# Altium schematic sheet Jump Stater.SchDoc
size A2; SheetNumber: 1; SheetTotal: 1
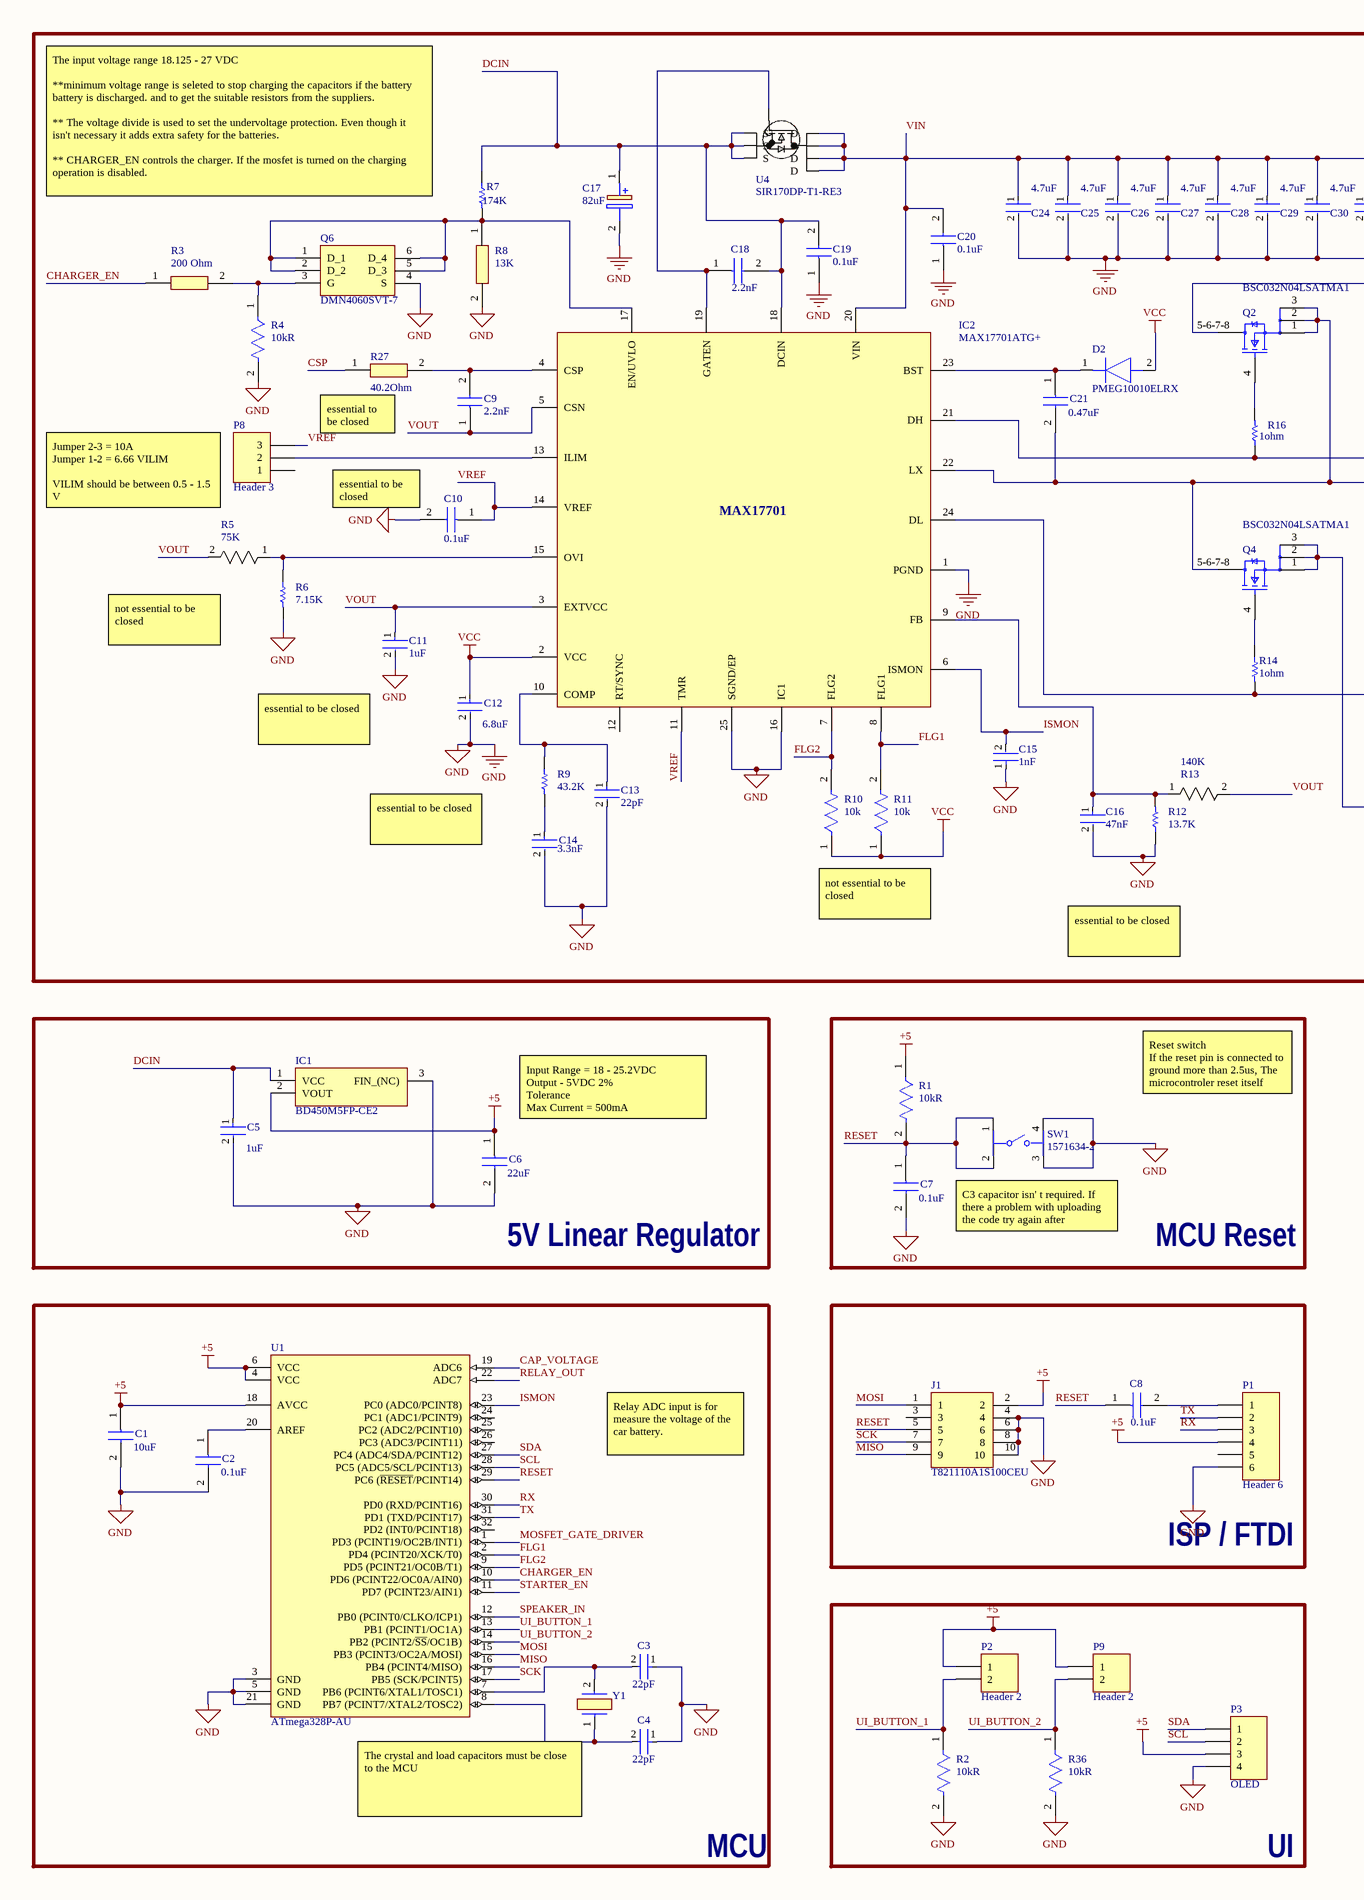
[diagram p0: Jump Stater.SchDoc, left]
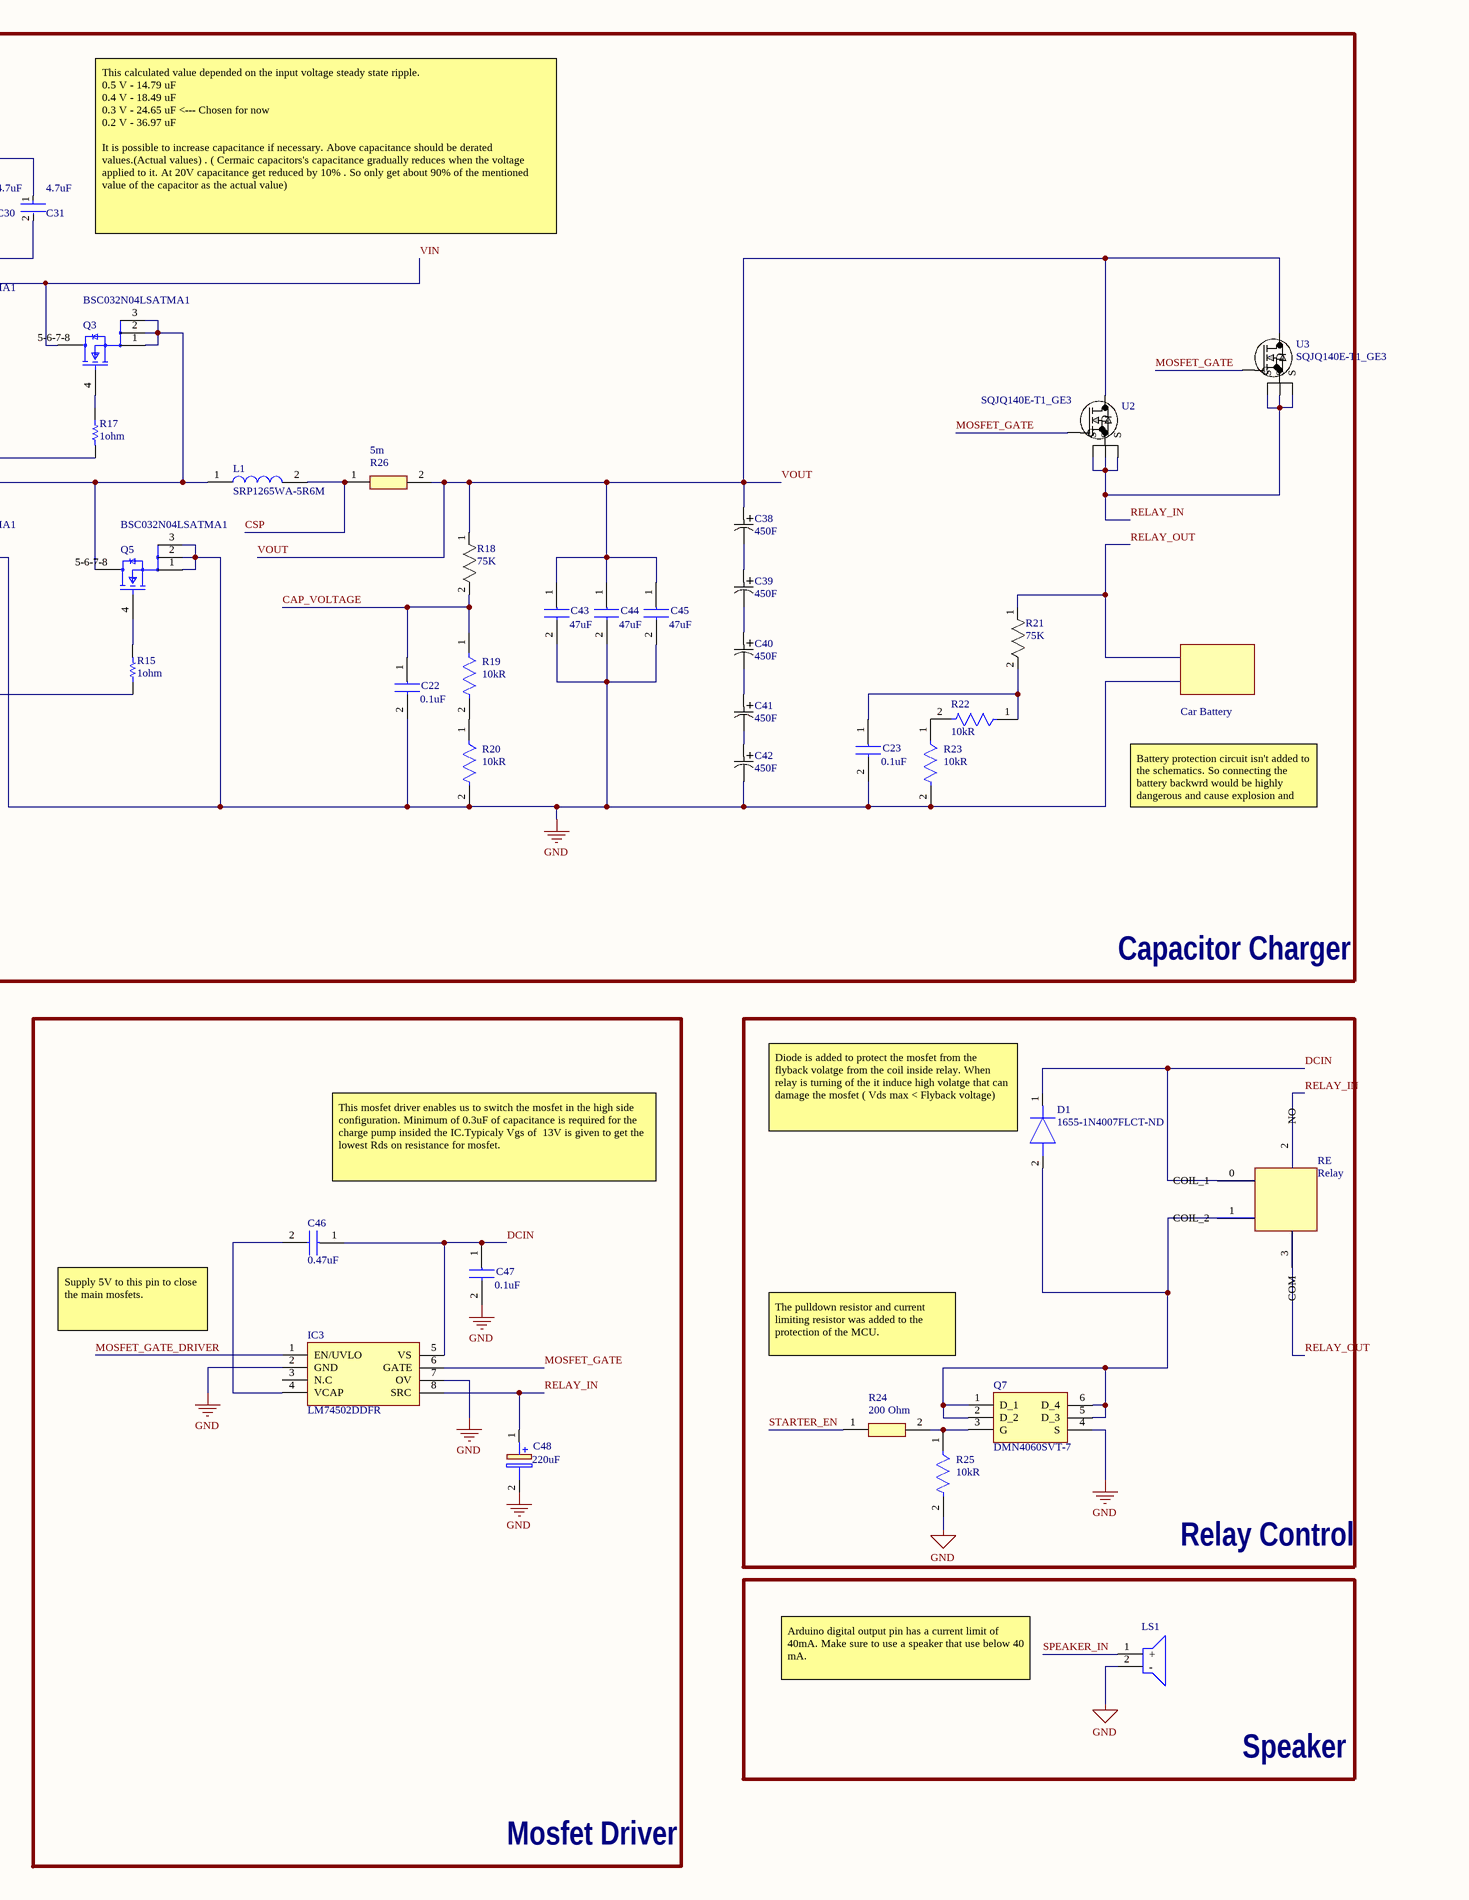
[diagram p1: Jump Stater.SchDoc, right]

## Parts
C1  Capacitance: 10uF  [CAPC3216X180N]  (hidden comment: CL31A106MAHNNNE)
C2  Capacitance: 0.1uF  [CAPC3216X100N]  (hidden comment: CL31B104KBCNNNC)
C3  Capacitance: 22pF  [FP-CL31-IPC_A]  (hidden comment: CL31C220JBCNNNC)
C4  Capacitance: 22pF  [FP-CL31-IPC_A]  (hidden comment: CL31C220JBCNNNC)
C5  Capacitance: 1uF  [FP-CL31-IPC_B]  (hidden comment: CL31B105KBHNNNE)
C6  Capacitance: 22uF  [CAPAE660X600N]  (hidden comment: A766EB226M1DLAE060)
C7  Capacitance: 0.1uF  [CAPC3216X100N]  (hidden comment: CL31B104KBCNNNC)
C8  Capacitance: 0.1uF  [CAPC3216X100N]  (hidden comment: CL31B104KBCNNNC)
C9  Capacitance: 2.2nF  [CAPC3216X90N]  (hidden comment: 1206B222K500CT)
C10  Capacitance: 0.1uF  [CAPC3216X100N]  (hidden comment: CL31B104KBCNNNC)
C11  Capacitance: 1uF  [FP-CL31-IPC_B]  (hidden comment: CL31B105KBHNNNE)
C12  Capacitance: 6.8uF  [FP-C3216-160-0_2-IPC_A]  (hidden comment: C3216X7R1C685K160AC)
C13  Capacitance: 22pF  [FP-CL31-IPC_A]  (hidden comment: CL31C220JBCNNNC)
C14  Capacitance: 3.3nF  [FP-1206-L_3_2_0_2-W_1_6_0-MFG]  (hidden comment: 12065A332JAT2A)
C15  Capacitance: 1nF  [FP-CL31-IPC_C]  (hidden comment: CL31B102KBCNNNC)
C16  Capacitance: 47nF  [FP-CL31-IPC_B]  (hidden comment: CL31B473KBCNNNC)
C17  Capacitance: 82uF  [CAPAE830X1240N]  (hidden comment: A768KS826M1HLAS020)
C18  Capacitance: 2.2nF  [CAPC3216X90N]  (hidden comment: 1206B222K500CT)
C19  Capacitance: 0.1uF  [CAPC3216X100N]  (hidden comment: CL31B104KBCNNNC)
C20  Capacitance: 0.1uF  [CAPC3216X100N]  (hidden comment: CL31B104KBCNNNC)
C21  Capacitance: 0.47uF  [CAPC3216X180N]  (hidden comment: CL31B474KBHNNNE)
C22  Capacitance: 0.1uF  [CAPC3216X100N]  (hidden comment: CL31B104KBCNNNC)
C23  Capacitance: 0.1uF  [CAPC3216X100N]  (hidden comment: CL31B104KBCNNNC)
C24  Capacitance: 4.7uF  [FP-GRM319-0_15-IPC_C]  (hidden comment: GRM319R61H475KA12D)
C25  Capacitance: 4.7uF  [FP-GRM319-0_15-IPC_C]  (hidden comment: GRM319R61H475KA12D)
C26  Capacitance: 4.7uF  [FP-GRM319-0_15-IPC_C]  (hidden comment: GRM319R61H475KA12D)
C27  Capacitance: 4.7uF  [FP-GRM319-0_15-IPC_C]  (hidden comment: GRM319R61H475KA12D)
C28  Capacitance: 4.7uF  [FP-GRM319-0_15-IPC_C]  (hidden comment: GRM319R61H475KA12D)
C29  Capacitance: 4.7uF  [FP-GRM319-0_15-IPC_C]  (hidden comment: GRM319R61H475KA12D)
C30  Capacitance: 4.7uF  [FP-GRM319-0_15-IPC_C]  (hidden comment: GRM319R61H475KA12D)
C31  Capacitance: 4.7uF  [FP-GRM319-0_15-IPC_C]  (hidden comment: GRM319R61H475KA12D)
C38  450F  [PCAP_TPLH-3R0/450SS35X71_TCT]
C39  450F  [PCAP_TPLH-3R0/450SS35X71_TCT]
C40  450F  [PCAP_TPLH-3R0/450SS35X71_TCT]
C41  450F  [PCAP_TPLH-3R0/450SS35X71_TCT]
C42  450F  [PCAP_TPLH-3R0/450SS35X71_TCT]
C43  Capacitance: 47uF  [CAPC3216X180N]  (hidden comment: C3216X5R1E476M160AC.)
C44  Capacitance: 47uF  [CAPC3216X180N]  (hidden comment: C3216X5R1E476M160AC.)
C45  Capacitance: 47uF  [CAPC3216X180N]  (hidden comment: C3216X5R1E476M160AC.)
C46  Capacitance: 0.47uF  [CAPC3216X180N]  (hidden comment: CL31B474KBHNNNE)
C47  Capacitance: 0.1uF  [CAPC3216X100N]  (hidden comment: CL31B104KBCNNNC)
C48  Capacitor: 220uF  [CAPAE1030X1270N]  (hidden comment: A768MS227M1GLAS022)
D1  1655-1N4007FLCT-ND  [SODFL3718X140N]
D2  PMEG10010ELRX  [SODFL3517X110N]
IC1  BD450M5FP-CE2  [ROHM_TO-252-3]
IC2  MAX17701ATG+  [QFN50P400X400X80-25N-D]
IC3  LM74502DDFR  [SOT65P280X110-8N]
J1  T821110A1S100CEU  [SHDR10W64P254X254_2X5_2032X895X915P]
L1  SRP1265WA-5R6M  [SRP1265WA5R6M]
LS1  (no value)  [CMI12950585T]
P1  Header 6  [HDR1X6]
P2  Header 2  [HDR1X2]
P3  OLED  [HDR1X4]
P8  Header 3  [HDR1X3]
P9  Header 2  [HDR1X2]
Q2  BSC032N04LSATMA1  [FP-PG-TDSON-8-MFG]
Q3  BSC032N04LSATMA1  [FP-PG-TDSON-8-MFG]
Q4  BSC032N04LSATMA1  [FP-PG-TDSON-8-MFG]
Q5  BSC032N04LSATMA1  [FP-PG-TDSON-8-MFG]
Q6  DMN4060SVT-7  [SOT95P280X100-6N]
Q7  DMN4060SVT-7  [SOT95P280X100-6N]
R1  Resistance: 10kR  [FP-RMCF1206-IPC_B]  (hidden comment: RMCF1206FT10K0)
R2  Resistance: 10kR  [FP-RMCF1206-IPC_B]  (hidden comment: RMCF1206FT10K0)
R3  Resistance: 200 Ohm  [RESC3216X70N]  (hidden comment: RMCF1206FT200R)
R4  Resistance: 10kR  [FP-RMCF1206-IPC_B]  (hidden comment: RMCF1206FT10K0)
R5  Resistance: 75K  [RC1206N_YAG]  (hidden comment: RC1206FR-0775KL)
R6  Resistance: 7.15K  [RESC3116X65X40ML10T20]  (hidden comment: RC1206FR-077K15L)
R7  value 174K  [RESC1206(3216)_L]  (hidden comment: 311-174KFRCT-ND)
R8  Resistance: 13K  [RESC3116X65N]  (hidden comment: RC1206FR-0713KL)
R9  Resistance: 43.2K  [RESC3116X65X40ML10T20]  (hidden comment: RC1206FR-0743K2L)
R10  Resistance: 10k  [FP-RMCF1206-IPC_B]  (hidden comment: RMCF1206FT10K0)
R11  Resistance: 10k  [FP-RMCF1206-IPC_B]  (hidden comment: RMCF1206FT10K0)
R12  Resistance: 13.7K  [RESC3216X70X40ML20T20]  (hidden comment: RK73H2BTTD1372F)
R13  Resistance: 140K  [RES_RMCF1206_STP]  (hidden comment: RMCF1206FT140K)
R14  Resistance: 1ohm  [RESC3216X70X40LL20T20]  (hidden comment: RK73H2BTTD1R00F)
R15  Resistance: 1ohm  [RESC3216X70X40LL20T20]  (hidden comment: RK73H2BTTD1R00F)
R16  Resistance: 1ohm  [RESC3216X70X40LL20T20]  (hidden comment: RK73H2BTTD1R00F)
R17  Resistance: 1ohm  [RESC3216X70X40LL20T20]  (hidden comment: RK73H2BTTD1R00F)
R18  Resistance: 75K  [RC1206N_YAG]  (hidden comment: RC1206FR-0775KL)
R19  Resistance: 10kR  [FP-RMCF1206-IPC_B]  (hidden comment: RMCF1206FT10K0)
R20  Resistance: 10kR  [FP-RMCF1206-IPC_B]  (hidden comment: RMCF1206FT10K0)
R21  Resistance: 75K  [RC1206N_YAG]  (hidden comment: RC1206FR-0775KL)
R22  Resistance: 10kR  [FP-RMCF1206-IPC_B]  (hidden comment: RMCF1206FT10K0)
R23  Resistance: 10kR  [FP-RMCF1206-IPC_B]  (hidden comment: RMCF1206FT10K0)
R24  Resistance: 200 Ohm  [RESC3216X70N]  (hidden comment: RMCF1206FT200R)
R25  Resistance: 10kR  [FP-RMCF1206-IPC_B]  (hidden comment: RMCF1206FT10K0)
R26  Resistance: 5m  [RESC6432X80N]  (hidden comment: CRF2512-FZ-R005ELF)
R27  Resistance: 40.2Ohm  [RESC3016X65N]  (hidden comment: CRT1206-BY-40R2ELF)
R36  Resistance: 10kR  [FP-RMCF1206-IPC_B]  (hidden comment: RMCF1206FT10K0)
RE  Relay  [PCBComponent_1]
SW1  1571634-2  [FP-1571634-2-MFG]
U1  ATmega328P-AU  [32A_M]
U2  SQJQ140E-T1_GE3  [DPAK_140E-T1_GE3_VIS]
U3  SQJQ140E-T1_GE3  [DPAK_140E-T1_GE3_VIS]
U4  SIR170DP-T1-RE3  [MOSFET_DP-T1-RE3_VIS]
Y1  ECS-160-20-3X-TR  [ECS160203XTR]  (value not drawn)

## Blocks framed on the sheet
Capacitor Charger: C9-C31 C38-C45 D2 IC2 L1 P8 Q2-Q6 R3-R23 R26 R27 U2-U4
5V Linear Regulator: C5 C6 IC1
MCU Reset: C7 R1 SW1
Mosfet Driver: C46-C48 IC3
Relay Control: D1 Q7 R24 R25 RE
MCU: C1-C4 U1 Y1
ISP / FTDI: C8 J1 P1
Speaker: LS1
UI: P2 P3 P9 R2 R36

## Nets
+5: C1.1 C6.1(+) IC1.2(VOUT) J1.2 P1.4 P2.1 P3.3 P9.1 R1.1 U1.4(VCC) U1.6(VCC) U1.18(AVCC)
GND: C1.2 C2.2 C3.1 C4.1 C5.2 C6.2(-) C7.2 C10.2 C11.2 C12.2 C13.2 C14.2 C15.1 C16.2 C17.2(-) C19.1 C20.1 C22.2 C23.2 C24.2 C25.2 C26.2 C27.2 C28.2 C29.2 C30.2 C31.2 C42.2 C43.2 C44.2 C45.2 C47.2 C48.2(-) IC1.3(FIN_(NC)) IC2.1(PGND) IC2.16(IC1) IC2.25(SGND/EP) IC3.2(GND) IC3.7(OV) J1.4 J1.6 J1.8 J1.10 LS1.2(-) P1.6 P3.4 Q4.1(S) Q4.2(S) Q4.3(S) Q5.1(S) Q5.2(S) Q5.3(S) Q6.4(S) Q7.4(S) R2.2 R4.2 R6.2 R8.2 R12.1 R20.2 R23.2 R25.2 R36.2 SW1.3 SW1.4 U1.3(GND) U1.5(GND) U1.21(GND)
VCC: C12.1 D2.2(A) IC2.2(VCC) R10.1 R11.1
CAP_VOLTAGE: C22.1 R18.2 R19.1 U1.19(ADC6)
CHARGER_EN: R3.1 U1.10(PD6_(PCINT22/OC0A/AIN0))
CSP: L1.2 R26.1 R27.1
DCIN: C5.1 C17.1(+) C18.2 C19.2 C46.1 C47.1 D1.1(K) IC1.1(VCC) IC2.18(DCIN) IC3.5(VS) R7.1 RE.0(COIL_1) U4.1(S) U4.2(S) U4.3(S)
FLG1: IC2.8(FLG1) R11.2 U1.2(PD4_(PCINT20/XCK/T0))
FLG2: IC2.7(FLG2) R10.2 U1.9(PD5_(PCINT21/OC0B/T1))
ISMON: C15.2 IC2.6(ISMON) U1.23(PC0_(ADC0/PCINT8))
MISO: J1.9 U1.16(PB4_(PCINT4/MISO))
MOSFET_GATE: IC3.6(GATE) U2.4(G) U3.4(G)
MOSFET_GATE_DRIVER: IC3.1(EN/UVLO) U1.1(PD3_(PCINT19/OC2B/INT1))
MOSI: J1.1 U1.15(PB3_(PCINT3/OC2A/MOSI))
RELAY_IN: C48.1(+) IC3.8(SRC) RE.2(NO) U2.1(S) U2.2(S) U2.3(S) U3.1(S) U3.2(S) U3.3(S)
RELAY_OUT: R21.1 RE.3(COM) U1.22(ADC7)
RESET: C7.1 C8.1 J1.5 R1.2 SW1.1 SW1.2 U1.29(PC6_(~{RESET}/PCINT14))
RX: P1.3 U1.30(PD0_(RXD/PCINT16))
SCK: J1.7 U1.17(PB5_(SCK/PCINT5))
SCL: P3.2 U1.28(PC5_(ADC5/SCL/PCINT13))
SDA: P3.1 U1.27(PC4_(ADC4/SDA/PCINT12))
SPEAKER_IN: LS1.1(+) U1.12(PB0_(PCINT0/CLKO/ICP1))
STARTER_EN: R24.1 U1.11(PD7_(PCINT23/AIN1))
TX: P1.2 U1.31(PD1_(TXD/PCINT17))
UI_BUTTON_1: P2.2 R2.1 U1.13(PB1_(PCINT1/OC1A))
UI_BUTTON_2: P9.2 R36.1 U1.14(PB2_(PCINT2/~{SS}/OC1B))
VIN: C20.2 C24.1 C25.1 C26.1 C27.1 C28.1 C29.1 C30.1 C31.1 IC2.20(VIN) Q2.5-6-7-8(D) Q3.5-6-7-8(D) U4.5(D) U4.6(D) U4.7(D) U4.8(D)
VOUT: C9.1 C11.1 C38.1 C43.1 C44.1 C45.1 IC2.3(EXTVCC) IC2.5(CSN) R5.2 R13.2 R18.1 R26.2 U2.5(D) U3.5(D)
VREF: C10.1 IC2.11(TMR) IC2.14(VREF) P8.3
NetC2_1: C2.1 U1.20(AREF)
NetC3_2: C3.2 U1.7(PB6_(PCINT6/XTAL1/TOSC1)) Y1.2(X2)
NetC4_2: C4.2 U1.8(PB7_(PCINT7/XTAL2/TOSC2)) Y1.1(X1)
NetC8_2: C8.2 P1.1
NetC9_2: C9.2 IC2.4(CSP) R27.2
NetC13_1: C13.1 IC2.10(COMP) R9.1
NetC14_1: C14.1 R9.2
NetC16_1: C16.1 IC2.9(FB) R12.2 R13.1
NetC18_1: C18.1 IC2.19(GATEN) U4.4(G)
NetC21_1: C21.1 D2.1(K) IC2.23(BST)
NetC21_2: C21.2 IC2.22(LX) L1.1 Q2.1(S) Q2.2(S) Q2.3(S) Q3.1(S) Q3.2(S) Q3.3(S) Q4.5-6-7-8(D) Q5.5-6-7-8(D)
NetC23_1: C23.1 R21.2 R22.1
NetC38_2: C38.2 C39.1
NetC39_2: C39.2 C40.1
NetC40_2: C40.2 C41.1
NetC41_2: C41.2 C42.1
NetC46_2: C46.2 IC3.4(VCAP)
NetD1_2: D1.2(A) Q7.1(D_1) Q7.2(D_2) Q7.5(D_3) Q7.6(D_4) RE.1(COIL_2)
NetIC2_13: IC2.13(ILIM) P8.2
NetIC2_15: IC2.15(OVI) R5.1 R6.1
NetIC2_17: IC2.17(EN/UVLO) Q6.1(D_1) Q6.2(D_2) Q6.5(D_3) Q6.6(D_4) R7.2 R8.1
NetIC2_21: IC2.21(DH) R16.1 R17.2
NetIC2_24: IC2.24(DL) R14.2 R15.1
NetQ2_4: Q2.4(G) R16.2
NetQ3_4: Q3.4(G) R17.1
NetQ4_4: Q4.4(G) R14.1
NetQ5_4: Q5.4(G) R15.2
NetQ6_3: Q6.3(G) R3.2 R4.1
NetQ7_3: Q7.3(G) R24.2 R25.1
NetR19_2: R19.2 R20.1
NetR22_2: R22.2 R23.1

Not connected (* = marked no-connect by the designer): IC2 12(RT/SYNC); IC3 3(N.C); J1 3; P1 5; P8 1; U1 24(PC1_(ADC1/PCINT9)) 25(PC2_(ADC2/PCINT10)) 26(PC3_(ADC3/PCINT11)) 32(PD2_(INT0/PCINT18))

## Notes on the sheet
- The input voltage range 18.125 - 27 VDC
  **minimum voltage range is seleted to stop charging the capacitors if the battery battery is discharged. and to get the suitable resistors from the suppliers.
  ** The voltage divide is used to set the undervoltage protection. Even though it isn't necessary it adds extra safety for the batteries.
  ** CHARGER_EN controls the charger. If the mosfet is turned on the charging operation is disabled.
- This calculated value depended on the input voltage steady state ripple.
  0.5 V - 14.79 uF
  0.4 V - 18.49 uF
  0.3 V - 24.65 uF <--- Chosen for now
  0.2 V - 36.97 uF
  It is possible to increase capacitance if necessary. Above capacitance should be derated values.(Actual values) . ( Cermaic capacitors's capacitance gradually reduces when the voltage applied to it. At 20V capacitance get reduced by 10% . So only get about 90% of the mentioned value of the capacitor as the actual value)
- (near R27) essential to be closed
- Jumper 2-3 = 10A
  Jumper 1-2 = 6.66 VILIM
  VILIM should be between 0.5 - 1.5 V
- (near C10) essential to be closed
- (near R5) not essential to be closed
- essential to be closed
- Car Battery
- Battery protection circuit isn't added to the schematics. So connecting the battery backwrd would be highly dangerous and cause explosion and fires in the battery.
- not essential to be closed
- (near C6) Input Range = 18 - 25.2VDC
  Output - 5VDC 2%
  Tolerance
  Max Current = 500mA
  TypQ Current = 38uA
- Reset switch
  If the reset pin is connected to ground more than 2.5us, The microcontroler reset itself
- (near D1) Diode is added to protect the mosfet from the flyback volatge from the coil inside relay. When relay is turning of the it induce high volatge that can damage the mosfet ( Vds max < Flyback voltage)
- This mosfet driver enables us to switch the mosfet in the high side configuration. Minimum of 0.3uF of capacitance is required for the charge pump insided the IC.Typicaly Vgs of  13V is given to get the lowest Rds on resistance for mosfet.
- C3 capacitor isn' t required. If there a problem with uploading the code try again after desoldering this
- Supply 5V to this pin to close the main mosfets.
- The pulldown resistor and current limiting resistor was added to the protection of the MCU.
- Relay ADC input is for measure the voltage of the car battery.
- Arduino digital output pin has a current limit of 40mA. Make sure to use a speaker that use below 40 mA.
- The crystal and load capacitors must be close to the MCU
- (in symbol MAX17701ATG+) MAX17701

## Library data of the parts
C1 = CL31A106MAHNNNE: CAP CER 10UF 25V X5R 1206 CL31A106MAHNNNE; Manufacturer_Name: SAMSUNG; Datasheet Link: https://www.arrow.com/en/products/cl31a106mahnnne/samsung-electro-mechanics; Height: 1.8mm; Manufacturer_Part_Number: CL31A106MAHNNNE; Mouser Part Number: 187-CL31A106MAHNNNE; Mouser Price/Stock: https://www.mouser.co.uk/ProductDetail/Samsung-Electro-Mechanics/CL31A106MAHNNNE?qs=9y2YoPkPyvYkOWbcUKSn%252BQ%3D%3D; Arrow Part Number: CL31A106MAHNNNE; Arrow Price/Stock: https://www.arrow.com/en/products/cl31a106mahnnne/samsung-electro-mechanics; Supplier 1: Digi-Key; Supplier Part Number 1: 1276-1181-1-ND
C2 C7 C10 C19 C20 C22 C23 C47 = CL31B104KBCNNNC: CAP CER 0.1UF 50V X7R 1206; Manufacturer_Name: SAMSUNG; Datasheet Link: https://datasheet.datasheetarchive.com/originals/distributors/Datasheets_SAMA/0fdb6a11e020a7299f4d0713dd2bd7ee.pdf; Height: 1mm; Mouser Part Number: 187-CL31B104KBCNNNC; Mouser Price/Stock: https://www.mouser.co.uk/ProductDetail/Samsung-Electro-Mechanics/CL31B104KBCNNNC?qs=349EhDEZ59oHABbyGq1iKA%3D%3D; Arrow Part Number: CL31B104KBCNNNC; Arrow Price/Stock: https://www.arrow.com/en/products/cl31b104kbcnnnc/samsung-electro-mechanics?region=nac; Supplier 1: Digi-Key; Supplier Part Number 1: 1276-1017-1-ND
  C2 C47: Manufacturer_Part_Number 1: CL31B104KBCNNNC
  C7 C10 C19 C20 C22 C23: Manufacturer_Part_Number: CL31B104KBCNNNC
C3 C4 C13 = CMP-13271-001055-1: Cap Ceramic 22pF 50V C0G ±5% SMD 1206 +125°C Embossed T/R; Temperature Coefficient: 300ppm/°C; Packaging: Tape and Reel; Material: Ceramic; Package Quantity: 1; Thickness: 0.039inch; Voltage: 50V; Height: 0.85mm; Radiation Hardening: No; Mount: Surface Mount; Width: 0.063inch; Min Operating Temperature: -55°C; Max Operating Temperature: 125°C; Voltage Rating (DC): 50V; Voltage Rating: 50V; Case/Package: 1206; Case Code (Metric): 3216; Tolerance: 5%; Length: 3.2mm; Dielectric: C0G; Lead Free: Lead Free; Depth: 1.6mm; Case Code (Imperial): 1206
C5 C11 = CMP-13271-001662-1: Cap Ceramic 1uF 50V X7R ±10% SMD 1206 +125°C Embossed T/R; Case Code (Metric): 3216; Packaging: Tape and Reel; Depth: 1.6mm; Max Operating Temperature: 125°C; Length: 3.2mm; Contact Plating: Tin; Voltage Rating (DC): 50V; Radiation Hardening: No; Min Operating Temperature: -55°C; Dielectric: X7R; Voltage: 50V; Lead Free: Lead Free; Package Quantity: 1; Material: Ceramic; Thickness: 0.071inch; Width: 0.063inch; Voltage Rating: 50V; Case Code (Imperial): 1206; Mount: Surface Mount; Case/Package: 1206; Tolerance: 10%; Height: 1.6mm
C6 = A766EB226M1DLAE060: CAP ALUM POLY 22UF 20% 20V SMD; Manufacturer_Name: KEMET; Datasheet Link: https://content.kemet.com/datasheets/KEM_A4089_A766.pdf; Height: 6mm; Manufacturer_Part_Number: A766EB226M1DLAE060; Mouser Part Number: 80-A766EB226M1DLAE60; Mouser Price/Stock: https://www.mouser.co.uk/ProductDetail/KEMET/A766EB226M1DLAE060?qs=vmHwEFxEFR9cZ7fvMzQbpw%3D%3D; Supplier 1: Digi-Key; Supplier Part Number 1: 399-A766EB226M1DLAE060CT-ND
C8 = CL31B104KBCNNNC: CAP CER 0.1UF 50V X7R 1206 CL31B104KBCNNNC; Manufacturer_Name: SAMSUNG; Datasheet Link: https://datasheet.datasheetarchive.com/originals/distributors/Datasheets_SAMA/0fdb6a11e020a7299f4d0713dd2bd7ee.pdf; Height: 1mm; Manufacturer_Part_Number: CL31B104KBCNNNC; Mouser Part Number: 187-CL31B104KBCNNNC; Mouser Price/Stock: https://www.mouser.co.uk/ProductDetail/Samsung-Electro-Mechanics/CL31B104KBCNNNC?qs=349EhDEZ59oHABbyGq1iKA%3D%3D; Arrow Part Number: CL31B104KBCNNNC; Arrow Price/Stock: https://www.arrow.com/en/products/cl31b104kbcnnnc/samsung-electro-mechanics?region=nac; Supplier 1: Digi-Key; Supplier Part Number 1: 1276-1017-1-ND
C9 C18 = 1206B222K500CT: Capacitor; Manufacturer_Name: Walsin Technology Corporation; Datasheet Link: https://eu.mouser.com/datasheet/2/210/WTC_MLCC_General_Purpose-1534899.pdf; Height: 0.9mm; Manufacturer_Part_Number: 1206B222K500CT; Supplier 1: Digi-Key; Supplier Part Number 1: 1292-1608-1-ND
C12 = CMP-08246-004935-1: Multilayer Ceramic Capacitors 6.8uF ±10% 16V X7R SMD 1206; Max Operating Temperature: 125°C; Construction: Flat; Resistor Type: Ceramic; Case Code (Imperial): 1206; Package Quantity: 1; Lead Free: Lead Free; Termination: SMD/SMT; Thickness: 0.071inch; Voltage Rating: 16V; Number of Pins: 2; Depth: 1.6mm; Tolerance: 10%; Radiation Hardening: No; Case Code (Metric): 3216; Length: 3.2mm; RoHS Compliant: Yes; Weight: 0.000571oz; Series: C; Height: 1.6mm; REACH SVHC: No SVHC; Packaging: Tape and Reel; Voltage: 16V; Mount: Surface Mount; Case/Package: 1206; Min Operating Temperature: -55°C; Dielectric Material: Ceramic; Width: 0.063inch; Dielectric: X7R; Voltage Rating (DC): 16V
C14 = CMP-1037-02951-2: General Purpose Ceramic Capacitor, 1206, 3.3nF, 5%, NP0, 30ppm/°C, 50V; Dissipation Factor: 2.5%; Dielectric: C0G; Mount: Surface Mount; Case/Package: 1206; Lead Free: Lead Free; Termination: SMD/SMT; Min Operating Temperature: -55°C; Temperature Coefficient: 30ppm/°C; Series: -; Contact Plating: Tin; Case Code (Imperial): 1206; Length: 3.2mm; REACH SVHC: No SVHC; Width: 0.063inch; Case Code (Metric): 3216; Thickness: 0.05inch; Dielectric Material: Ceramic; Max Operating Temperature: 125°C; Packaging: Tape and Reel; Construction: Flat; Number of Pins: 2; Voltage Rating (DC): 50V; Package Quantity: 1; RoHS Compliant: Yes; Voltage: 50V; Height: 1.27mm; Depth: 1.6mm; Voltage Rating: 50V; Tolerance: 5%; Radiation Hardening: No
C15 = CMP-13271-001948-1: Cap Ceramic 1nF 50V X7R ±10% SMD 1206 +125°C Embossed T/R; Voltage: 63V; Case Code (Imperial): 1206; Depth: 1.6mm; Case Code (Metric): 3216; Width: 0.063inch; Package Quantity: 4000; Height: 0.85mm; Max Operating Temperature: 125°C; Radiation Hardening: No; Thickness: 0.037inch; Tolerance: 10%; Case/Package: 1206; Packaging: Tape and Reel; Voltage Rating (DC): 50V; Min Operating Temperature: -55°C; Material: Ceramic; Length: 3.2mm; Voltage Rating: 50V; Mount: Surface Mount; Lead Free: Lead Free; Dielectric: X7R
C16 = CMP-13271-000358-1: Cap Ceramic 47nF 50V X7R ±10% SMD 1206 +125°C Embossed T/R; Case Code (Metric): 3216; Depth: 1.6mm; Mount: Surface Mount; Min Operating Temperature: -55°C; Case/Package: 1206; Height: 0.85mm; Packaging: Tape and Reel; Thickness: 0.039inch; Max Operating Temperature: 125°C; Dielectric: X7R; Case Code (Imperial): 1206; Material: Ceramic; Tolerance: 10%; Lead Free: Lead Free; Radiation Hardening: No; Voltage Rating (DC): 50V; Length: 3.2mm; Voltage Rating: 50V; Width: 0.063inch; Voltage: 50V
C17 = A768KS826M1HLAS020: CAP ALUM POLY 82UF 20% 50V SMD; Manufacturer_Name: KEMET; Datasheet Link: https://content.kemet.com/datasheets/KEM_A4088_A768.pdf; Height: 12.4mm; Manufacturer_Part_Number: A768KS826M1HLAS020; Mouser Part Number: 80-A768KS826M1HLAS20; Mouser Price/Stock: https://www.mouser.co.uk/ProductDetail/KEMET/A768KS826M1HLAS020?qs=yqaQSyyJnNiK6owm%2FGFRvA%3D%3D; Supplier 1: Digi-Key; Supplier Part Number 1: 399-A768KS826M1HLAS020CT-ND
C21 C46 = CL31B474KBHNNNE: CAP CER 0.47UF 50V X7R 1206; Manufacturer_Name: SAMSUNG; Datasheet Link: https://datasheet.datasheetarchive.com/originals/distributors/Datasheets_SAMA/624d57f8861bc75ef1b47830d520ec0a.pdf; Height: 1.8mm; Manufacturer_Part_Number: CL31B474KBHNNNE; Mouser Part Number: 187-CL31B474KBHNNNE; Mouser Price/Stock: https://www.mouser.co.uk/ProductDetail/Samsung-Electro-Mechanics/CL31B474KBHNNNE?qs=349EhDEZ59olbv7Lkudghw%3D%3D; Arrow Part Number: CL31B474KBHNNNE; Arrow Price/Stock: https://www.arrow.com/en/products/cl31b474kbhnnne/samsung-electro-mechanics?region=nac; Supplier 1: Digi-Key; Supplier Part Number 1: 1276-1118-1-ND
C24-C31 = CMP-06035-020548-1: Chip Multilayer Ceramic Capacitors for General Purpose, 1206, 4.7uF, X5R, 15%, 10%, 50V; Min Operating Temperature: -55°C; Max Operating Temperature: 85°C; Thickness: 850um; Depth: 1.6mm; Material: Ceramic; Voltage Rating: 50V; Mount: Surface Mount; Height: 0.85mm; Length: 3.2mm; Width: 1.6mm; Case/Package: 1206; Packaging: Cut Tape; Dielectric: X5R; Case Code (Metric): 3216; Voltage Rating (DC): 50V; REACH SVHC: No SVHC; Case Code (Imperial): 1206; Voltage: 50V; Tolerance: 10%
C38-C42 = TPLH-3R0/450SS35X71: No Description Available; Mfr_Name: TECATE GROUP; Supplier 1: Digi-Key; Supplier Part Number 1: 2085-TPLH-3R0/450SS35X71-ND
C43-C45 = C3216X5R1E476M160AC.: 47 µF ±20% 25V Ceramic Capacitor X5R 1206 (3216 Metric); Manufacturer_Name: TDK; Datasheet Link: https://media.digikey.com/pdf/Data%20Sheets/TDK%20PDFs/mlcc_commercial_general_Rev2018.pdf; Height: 1.8mm; Manufacturer_Part_Number: C3216X5R1E476M160AC.; Mouser Part Number: N/A; Mouser Price/Stock: https://www.mouser.com/Search/Refine.aspx?Keyword=N%2FA; Supplier 1: Digi-Key; Supplier Part Number 1: 445-8047-1-ND
C48 = A768MS227M1GLAS022: Capacitor Polarised; Manufacturer_Name: KEMET; Datasheet Link: https://connect.kemet.com:7667/gateway/IntelliData-ComponentDocumentation/1.0/download/specsheet/A768MS227M1GLAS022; Height: 12.7mm; Manufacturer_Part_Number: A768MS227M1GLAS022; Supplier 1: Digi-Key; Supplier Part Number 1: 399-A768MS227M1GLAS022CT-ND
D1 = 1N4007FLTR: Diode; Manufacturer_Name: SMC; Datasheet Link: http://www.smc-diodes.com/propdf/1N4001FL-1N4007FL%20N1646%20REV.A.pdf; Height: 1.4mm; Manufacturer_Part_Number: 1N4007FLTR
D2 = PMEG10010ELRX: Diode; Manufacturer_Name: Nexperia; Datasheet Link: https://assets.nexperia.com/documents/data-sheet/PMEG10010ELR.pdf; Height: 1.1mm; Manufacturer_Part_Number: PMEG10010ELRX; Mouser Part Number: 771-PMEG10010ELRX; Mouser Price/Stock: https://www.mouser.co.uk/ProductDetail/Nexperia/PMEG10010ELRX?qs=bel5lzaZNxTBP7lsf64PhA%3D%3D; Arrow Part Number: PMEG10010ELRX; Arrow Price/Stock: https://www.arrow.com/en/products/pmeg10010elrx/nexperia?region=nac; Supplier 1: Digi-Key; Supplier Part Number 1: 1727-2394-1-ND
IC1 = BD450M5FP-CE2: Integrated Circuit; Manufacturer_Name: ROHM Semiconductor; Datasheet Link: https://datasheet.datasheetarchive.com/originals/distributors/DKDS-10/186386.pdf; Manufacturer_Part_Number: BD450M5FP-CE2; Mouser Part Number: 755-BD450M5FP-CE2; Mouser Price/Stock: https://www.mouser.co.uk/ProductDetail/ROHM-Semiconductor/BD450M5FP-CE2?qs=zGux8KhMp6L1UcqyCxjOAw%3D%3D; Supplier 1: Digi-Key; Supplier Part Number 1: BD450M5FP-CE2CT-ND
IC2 = MAX17701ATG+: Integrated Circuit; Manufacturer_Name: Analog Devices; Datasheet Link: https://pdfserv.maximintegrated.com/en/ds/MAX17701.pdf; Height: 0.8mm; Manufacturer_Part_Number: MAX17701ATG+; Mouser Part Number: 700-MAX17701ATG+; Mouser Price/Stock: https://www.mouser.co.uk/ProductDetail/Maxim-Integrated/MAX17701ATG%2b?qs=W%2FMpXkg%252BdQ4lZ0yRy8rVtg%3D%3D; Arrow Part Number: MAX17701ATG+; Arrow Price/Stock: https://www.arrow.com/en/products/max17701atg/maxim-integrated?region=nac; Supplier 1: Digi-Key; Supplier Part Number 1: 175-MAX17701ATG+-ND
IC3 = LM74502DDFR: Integrated Circuit; Manufacturer_Name: Texas Instruments; Datasheet Link: https://www.arrow.com/en/products/lm74502ddfr/texas-instruments?region=nac; Height: 1.1mm; Manufacturer_Part_Number: LM74502DDFR; Mouser Part Number: 595-LM74502DDFR; Mouser Price/Stock: https://www.mouser.co.uk/ProductDetail/Texas-Instruments/LM74502DDFR?qs=doiCPypUmgHnIUX9P1FS2A%3D%3D; Arrow Part Number: LM74502DDFR; Arrow Price/Stock: https://www.arrow.com/en/products/lm74502ddfr/texas-instruments?region=nac; Supplier 1: Digi-Key; Supplier Part Number 1: 296-LM74502DDFRCT-ND
J1 = T821110A1S100CEU: Connector; Manufacturer_Name: Amphenol; Datasheet Link: https://docs.rs-online.com/e09c/0900766b81359cba.pdf; Height: 9.15mm; Manufacturer_Part_Number: T821110A1S100CEU; Mouser Part Number: N/A; Mouser Price/Stock: https://www.mouser.co.uk/ProductDetail/Amphenol/T821110A1S100CEU?qs=3IN%252Br8p6BrNf%2FuKCWm44Bg%3D%3D; Arrow Part Number: T821110A1S100CEU; Arrow Price/Stock: https://www.arrow.com/en/products/t821110a1s100ceu/amphenol-fci?region=europe
L1 = SRP1265WA-5R6M: Inductor; Manufacturer_Name: Bourns; Datasheet Link: http://www.bourns.com/docs/Product-Datasheets/SRP1265WA.pdf; Height: 6.5mm; Manufacturer_Part_Number: SRP1265WA-5R6M; Mouser Part Number: 652-SRP1265WA-5R6M; Mouser Price/Stock: https://www.mouser.co.uk/ProductDetail/Bourns/SRP1265WA-5R6M?qs=81r%252BiQLm7BQx3ztxL9cqwg%3D%3D; Supplier 1: Digi-Key; Supplier Part Number 1: 118-SRP1265WA-5R6MCT-ND
LS1 = CMI-1295-0585T: Loudspeaker or Buzzer; Manufacturer_Name: CUI Devices; Datasheet Link: https://www.cuidevices.com/product/resource/pdf/cmi-1295-0585t.pdf; Height: 9.7mm; Manufacturer_Part_Number: CMI-1295-0585T; Mouser Part Number: 490-CMI-1295-0585T; Mouser Price/Stock: https://www.mouser.co.uk/ProductDetail/CUI-Devices/CMI-1295-0585T?qs=P1JMDcb91o6b8IYPugSq6A%3D%3D; Arrow Part Number: CMI-1295-0585T; Arrow Price/Stock: https://www.arrow.com/en/products/cmi-1295-0585t/cui-devices?region=nac; Supplier 1: Digi-Key; Supplier Part Number 1: 102-CMI-1295-0585T-ND
P1 = Header 6: Header, 6-Pin; LatestRevisionDate: 17-Jul-2002; LatestRevisionNote: Re-released for DXP Platform.; Publisher: Altium Limited
P2 P9 = Header 2: Header, 2-Pin; LatestRevisionDate: 17-Jul-2002; LatestRevisionNote: Re-released for DXP Platform.; Publisher: Altium Limited
P3 = Header 4: Header, 4-Pin; LatestRevisionDate: 17-Jul-2002; LatestRevisionNote: Re-released for DXP Platform.; Publisher: Altium Limited
P8 = Header 3: Header, 3-Pin; LatestRevisionDate: 17-Jul-2002; LatestRevisionNote: Re-released for DXP Platform.; Publisher: Altium Limited
Q2-Q5 = CMP-1091-00015-2: MOSFET N-CH 40V 21A/98A TDSON; Rise Time: 4ns; Power Dissipation: 2.5W; Continuous Drain Current (ID): 98A; Number of Elements: 1; Gate to Source Voltage (Vgs): 20V; Rds On Max: 3.2mR; Max Power Dissipation: 52W; Input Capacitance: 1.8nF; Drain to Source Voltage (Vdss): 40V; Lead Free: Contains Lead; Number of Pins: 8; Packaging: Tape and Reel; Max Dual Supply Voltage: 40V; Halogen Free: Halogen Free; Max Operating Temperature: 150°C; RoHS Compliant: Yes; Min Operating Temperature: -55°C; Series: OptiMOS™; Mount: Surface Mount
Q6 Q7 = DMN4060SVT-7: MOSFET (N-Channel); Manufacturer_Name: Diodes Inc.; Datasheet Link: https://datasheet.lcsc.com/szlcsc/Diodes-Incorporated-DMN4060SVT-7_C155314.pdf; Height: 1mm; Manufacturer_Part_Number: DMN4060SVT-7; Mouser Part Number: 621-DMN4060SVT-7; Mouser Price/Stock: https://www.mouser.co.uk/ProductDetail/Diodes-Incorporated/DMN4060SVT-7?qs=gfe7vQ8txpVnyiyrFKlC5Q%3D%3D; Arrow Part Number: DMN4060SVT-7; Arrow Price/Stock: https://www.arrow.com/en/products/dmn4060svt-7/diodes-incorporated?region=asia; Supplier 1: Digi-Key; Supplier Part Number 1: DMN4060SVT-7DICT-ND
R1 R4 R10 R11 R19 R20 R22 R23 R25 = CMP-26527-000151-1: 10kΩ ±1% 0.25W 1206 Thick Film Chip Resistor AEC-Q200 compliant RMCF1206FT10K0; Temperature Coefficient: 100ppm/°C; Max Power Dissipation: 250mW; Packaging: Tape and Reel; Resistor Type: Thick Film; Number of Terminations: 2; Depth: 1.6mm; Military Standard: Not; Contact Plating: Tin; Radiation Hardening: No; Lead Free: Lead Free; Tolerance: 1%; Length: 3.2mm; Size Code: 1206; RoHS Compliant: Yes; Case/Package: 1206; Mount: Surface Mount; Features: Automotive AEC-Q200; Min Operating Temperature: -55°C; Series: RMCF; Case Code (Imperial): 1206; Construction: Rectangular; Max Operating Temperature: 155°C; Width: 0.063inch; Height: 0.028inch; Power Rating: 250mW; Case Code (Metric): 3216
R2 R36 = CMP-26527-000151-1: 10kΩ ±1% 0.25W 1206 Thick Film Chip Resistor AEC-Q200 compliant; Temperature Coefficient: 100ppm/°C; Max Power Dissipation: 250mW; Packaging: Tape and Reel; Resistor Type: Thick Film; Number of Terminations: 2; Depth: 1.6mm; Military Standard: Not; Contact Plating: Tin; Radiation Hardening: No; Lead Free: Lead Free; Tolerance: 1%; Length: 3.2mm; Size Code: 1206; RoHS Compliant: Yes; Case/Package: 1206; Mount: Surface Mount; Features: Automotive AEC-Q200; Min Operating Temperature: -55°C; Series: RMCF; Case Code (Imperial): 1206; Construction: Rectangular; Max Operating Temperature: 155°C; Width: 0.063inch; Height: 0.028inch; Power Rating: 250mW; Case Code (Metric): 3216
R3 R24 = RMCF1206FT200R: RES 200 OHM 1% 1/4W 1206; Manufacturer_Name: Stackpole Electronics; Datasheet Link: https://cs.seielect.com/catalog/SEI-RMCF_RMCP.pdf; Height: 0.7mm; Manufacturer_Part_Number: RMCF1206FT200R; Supplier 1: Digi-Key; Supplier Part Number 1: RMCF1206FT200RCT-ND
R5 R18 R21 = RC1206FR-0775KL: No Description Available; Mfr_Name: Yageo; Digi-Key_Part_Number_4: 311-75.0KFRTR-NDL; Digi-Key_Part_Number_3: 311-75.0KFRTR-ND; Digi-Key_Part_Number_1: 311-75.0KFRCT-ND; Digi-Key_Part_Number_2: 311-75.0KFRDKR-ND; Supplier 1: Digi-Key; Supplier Part Number 1: 311-75.0KFRCT-ND
R6 = CMP-2003-03868-1: Manufacturer: Yageo; Part Number: RC1206FR-077K15L
R7 = CMP-1014-00761-1: 174K 0.25W 1% 1206 (3216 Metric)  SMD; Case-EIA: 1206; Case-Metric: 3216; Power: 0.25 W; Technology: SMT; Tolerance: 1 %
R8 = RC1206FR-0713KL: Resistor; Manufacturer_Name: KEMET; Datasheet Link: https://www.sos.sk/productdata/35/10/4/35104/RC1206.pdf; Height: 0.65mm; Manufacturer_Part_Number: RC1206FR-0713KL; Mouser Part Number: 603-RC1206FR-0713KL; Mouser Price/Stock: https://www.mouser.co.uk/ProductDetail/Yageo/RC1206FR-0713KL?qs=%2FbpERZPLKKvEuZQr9uTFqA%3D%3D; Supplier 1: Future Electronics; Supplier Part Number 1: 2113674
R9 = CMP-2003-03769-1: Manufacturer: Yageo; Part Number: RC1206FR-0743K2L
R12 = CMP-2003-01241-1: RES 13.7K OHM 1% 1/4W 1206; Manufacturer: KOA Speer; Part Number: RK73H2BTTD1372F
R13 = RMCF1206FT140K: No Description Available; Mfr_Name: Stackpole International; Supplier 1: Digi-Key; Supplier Part Number 1: 738-RMCF1206FT140KCT-ND
R14-R17 = CMP-2003-01299-1: Manufacturer: KOA Speer; Part Number: RK73H2BTTD1R00F
R26 = CRF2512-FZ-R005ELF: RES 0.005 OHM 1% 2W 2512; Manufacturer_Name: Bourns; Datasheet Link: https://www.arrow.com/en/products/crf2512-fz-r005elf/bourns; Height: 0.8mm; Manufacturer_Part_Number: CRF2512-FZ-R005ELF; Mouser Part Number: 652-CRF2512FZR005ELF; Mouser Price/Stock: https://www.mouser.co.uk/ProductDetail/Bourns/CRF2512-FZ-R005ELF?qs=iHX4uCgIbgMqZUuYK4Zqgg%3D%3D; Arrow Part Number: CRF2512-FZ-R005ELF; Arrow Price/Stock: https://www.arrow.com/en/products/crf2512-fz-r005elf/bourns?region=nac; Supplier 1: Digi-Key; Supplier Part Number 1: CRF2512-FZ-R005ELFCT-ND
R27 = CRT1206-BY-40R2ELF: RES SMD 40.2 OHM 0.1% 1/4W 1206; Manufacturer_Name: Bourns; Datasheet Link: http://www.bourns.com/docs/Product-Datasheets/crt-as.pdf; Height: 0.65mm; Manufacturer_Part_Number: CRT1206-BY-40R2ELF; Mouser Part Number: 652-CRT1206BY40R2ELF; Mouser Price/Stock: https://www.mouser.co.uk/ProductDetail/Bourns/CRT1206-BY-40R2ELF?qs=oyIm%2F3giSj7POPsE94YyZg%3D%3D; Supplier 1: Digi-Key; Supplier Part Number 1: 118-CRT1206-BY-40R2ELFCT-ND
SW1 = CMP-03407-000008-1: SWITCH TACTILE SPST-NO 0.05A 24V; Actuator Length: 0.094inch; Max Current Rating: 50mA; Voltage Rating (DC): 12V; Actuator Material: Rubber; Switch Function: Off-Mom; Mechanical Life: 5000000Cycles; Actuator Type: Standard; Actuator Color: Natural; Illumination Type: Illuminated; Operating Force: 160gf; Throw Configuration: SPST; Package Quantity: 1000; Max Operating Temperature: 85°C; Mount: Surface Mount; Contact Plating: Silver; Depth: 10mm; Min Operating Temperature: -40°C; Radiation Hardening: No; ELV: Compliant; Case/Package: SMD/SMT; Length: 6.2mm; Termination: Gull Wing; Type: Switch; RoHS Compliant: Yes; Current Rating: 50mA; Contact Current Rating: 50mA; Orientation: Straight; Packaging: Tape and Reel; Max Voltage Rating (DC): 12V; Lead Free: Lead Free; Contact Material: Stainless Steel
U1 = CMP-0095-00269-2: 8-bit AVR Microcontroller, 32KB Flash, 1KB EEPROM, 2KB SRAM, 32-pin TQFP, Industrial Grade (-40°C to 85°C); PackageDescription: 32-Lead, 7x7x1.0 mm Body, 0.8mm Lead Pitch, Thin Profile Plastic Quad Flat Package (TQFP); DatasheetVersion: revD, May-2011; RevisionNote: DatasheetVersion & PackageVersion updated. URLs added.; ComponentLink1URL: http://www.atmel.com/; ComponentLink2Description: ATmega48A/48PA/88A/88PA/168A/168PA/328/328P Datasheet; Code_JEDEC: MS-026-ABA; ComponentLink1Description: Manufacturer URL; PackageReference: 32A; ComponentLink3Description: ATmega48A/48PA/88A/88PA/168A/168PA/328/328P Summary; ComponentLink2URL: http://www.atmel.com/dyn/resources/prod_documents/doc8271.pdf; PackageVersion: revC, Oct-2010; ComponentLink3URL: http://www.atmel.com/dyn/resources/prod_documents/8271S.pdf
U2 U3 = SQJQ140E-T1_GE3: No Description Available; Mfr_Name: Vishay; Supplier 1: Digi-Key; Supplier Part Number 1: 742-SQJQ140E-T1_GE3CT-ND
U4 = SIR170DP-T1-RE3: No Description Available; Mfr_Name: Vishay; Supplier 1: Digi-Key; Supplier Part Number 1: SIR170DP-T1-RE3CT-ND
Y1 = ECS-160-20-3X-TR: Crystal or Oscillator; Manufacturer_Name: ECS; Datasheet Link: https://www.arrow.com/en/products/ecs-160-20-3x-tr/ecs-international; Height: 2.3mm; Manufacturer_Part_Number: ECS-160-20-3X-TR; Mouser Part Number: 520-160-20-3XT; Mouser Price/Stock: https://www.mouser.co.uk/ProductDetail/ECS/ECS-160-20-3X-TR?qs=7Z%2FjUg96RbU1ElbRFXn8Rw%3D%3D; Arrow Part Number: ECS-160-20-3X-TR; Arrow Price/Stock: https://www.arrow.com/en/products/ecs-160-20-3x-tr/ecs-international?region=nac; Supplier 1: Digi-Key; Supplier Part Number 1: XC1776CT-ND